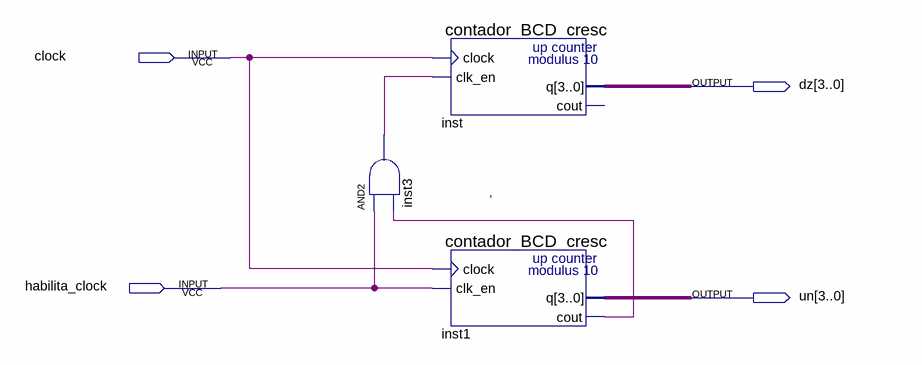
[diagram p0: schematic sheet]
// Quartus schematic count_cresc_mod_100.bdf as structural Verilog: 3 symbols, 4 pins
module count_cresc_mod_100 (
  input  clock,
  input  habilita_clock,
  output [3:0] dz,
  output [3:0] un
);

  wire inst1_cout, inst3_out;

  and inst3 (inst3_out, habilita_clock, inst1_cout);
  contador_BCD_cresc inst (.clock(clock), .clk_en(inst3_out), .q(dz));  // open: cout
  contador_BCD_cresc inst1 (.clock(clock), .clk_en(habilita_clock), .q(un), .cout(inst1_cout));

  // Notes on the sheet:
  //   '
endmodule
